# Altium project toilet-sensing-v0.1.PrjPcb
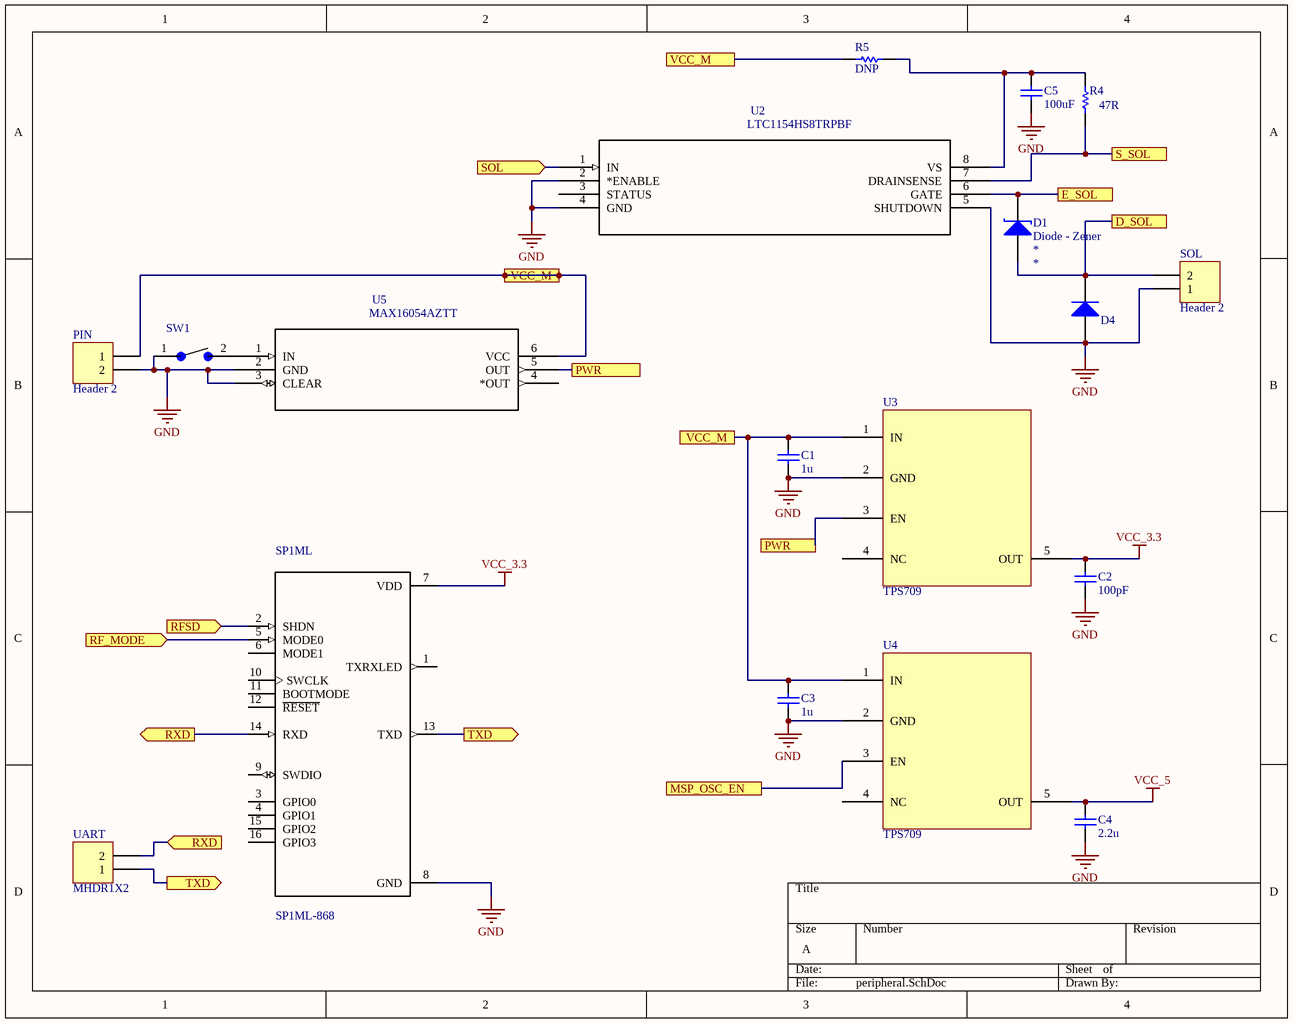
[diagram p0: peripheral.SchDoc]
2 sheets, 31 parts. Net scope: flat (ports and power ports of the same name join across sheets).
Board file: FlowSense-RX.PcbDoc
Sheets:
  peripheral.SchDoc
  MSP430.SchDoc

## Sheet peripheral.SchDoc
size A

### Parts
C1  value 1u  [0402-W]  (hidden comment: Cap)
C2  value 100pF  [0402-W]  (hidden comment: Cap)
C3  value 1u  [0402-W]  (hidden comment: Cap)
C4  value 2.2u  [0402-W]  (hidden comment: Cap)
C5  value 100uF  [0402-W]  (hidden comment: Cap)
D1  Diode - Zener  [SOD-523]
D4  Diode  [DIODE - SOD123]  (value not drawn)
PIN  Header 2  [HDR1X2]
R4  value 47R  [0402]  (hidden comment: R_Pullup_1)
R5  value DNP  [0402]  (hidden comment: R_Pullup_1)
SOL  Header 2  [HDR1X2]
SP1ML  SP1ML-868  [STM_SP1ML-868]
SW1  FSMSM _1437566-3_  [TE_FSMSM]  (value not drawn)
U2  LTC1154HS8TRPBF  [SOIC-8_S]
U3  TPS709  [SOT95P280X145-5N]
U4  TPS709  [SOT95P280X145-5N]
U5  MAX16054AZTT  [21-0114C]
UART  MHDR1X2  [MHDR1X2]

### Ports
D_SOL, E_SOL, MSP_OSC_EN, PWR, RF_MODE (in), RFSD (in), RXD (in), RXD (out), S_SOL, SOL (in), TXD (out), VCC_M

### Nets
GND: C1.1 C2.1 C3.1 C4.1 C5.1 D4.1(A) PIN.2 SOL.1 SP1ML.8(GND) SW1.1 U2.2(*ENABLE) U2.4(GND) U2.5(SHUTDOWN) U3.2(GND) U4.2(GND) U5.2(GND) U5.3(CLEAR)
VCC_3.3: C2.2 SP1ML.7(VDD) U3.5(OUT)
VCC_5: C4.2 U4.5(OUT)
NetC1_2: C1.2 C3.2 PIN.1 R5.2 U3.1(IN) U4.1(IN) U5.6(VCC) ; port VCC_M
NetC5_2: C5.2 R4.2 R5.1 U2.8(VS)
NetD1_1: D1.1(A) D4.2(C) SOL.2 ; port D_SOL
NetD1_2: D1.2(K) U2.6(GATE) ; port E_SOL
NetR4_1: R4.1 U2.7(DRAINSENSE) ; port S_SOL
NetSP1ML_2: SP1ML.2(SHDN) ; port RFSD
NetSP1ML_5: SP1ML.5(MODE0) ; port RF_MODE
NetSP1ML_13: SP1ML.13(TXD) UART.1 ; port TXD
NetSP1ML_14: SP1ML.14(RXD) UART.2 ; port RXD
NetSW1_2: SW1.2 U5.1(IN)
NetU1_3: U2.1(IN) ; port SOL
NetU1_16: U4.3(EN) ; port MSP_OSC_EN
NetU3_3: U3.3(EN) U5.5(OUT) ; port PWR

Not connected (* = marked no-connect by the designer): SP1ML 1(TXRXLED) 3(GPIO0) 4(GPIO1) 6(MODE1) 9(SWDIO) 10(SWCLK) 11(BOOTMODE) 12(~{RESET}) 15(GPIO2) 16(GPIO3); U2 3(STATUS); U3 4(NC); U4 4(NC); U5 4(*OUT)

### Library data of the parts
C1-C5 = Cap: Ceramic Capacitor (Surface Mount); Manufacturer: Generic Ceramic Chip Cap (TBD); Digi-Key Part Number: *; Manufacturer Part Number: *; Note: *; Rating: *
D4 = Diode: General Purpose Diode; Manufacturer: *; Manufacturer Part Number: *; Digi-Key Part Number: *; Value: *; Rating: *; Note: *
PIN SOL = Header 2: Header, 2-Pin; LatestRevisionDate: 17-Jul-2002; LatestRevisionNote: Re-released for DXP Platform.; Publisher: Altium Limited
R4 R5 = Res: Chip Resistor (Surface Mount); Manufacturer: Generic Chip Res (TBD); Manufacturer Part Number: *; Digi-Key Part Number: *; Rating: *; Comment_1: Res
SP1ML = SP1ML-868: RF TXRX MODULE ISM<1GHZ CHIP ANT; MF: STMicroelectronics; Availability: Good; MP: SP1ML-868; Price: 16.88 USD; Package: SMD-16 STMicroelectronics; Value: *
SW1 = FSMSM: FSMSM=3.5X6 SMT TACT; MF: TE Connectivity; Price: None; SnapEDA_Link: https://www.snapeda.com/parts/FSMSM/TE%20Connectivity%20/%20DEUTSCH/view-part/?ref=snap; MP: FSMSM; Availability: Unavailable; Package: None; Value: *
U2 = LTC1154HS8TRPBF: IC MOSFET DRIVER HIGH-SIDE 8SOIC; MF: Linear Technology; MP: LTC1154HS8#TRPBF; Price: 2.92 USD; Package: SOIC-8 Linear Technology; Availability: Unavailable; Value: *
U3 U4 = TPS709: Ultra low power Voltage Regulator
U5 = MAX16054AZTT: On/Off Controller With Debounce And +/-1; MF: Maxim Integrated; MP: MAX16054AZT+; SnapEDA_Link: https://www.snapeda.com/parts/MAX16054AZT%2B/Maxim%20Integrated/view-part/?ref=snap; Package: TSOT-23 Maxim Integrated; Price: 2.94 USD; Availability: Unavailable; Value: *
UART = MHDR1X2: Header, 2-Pin; LatestRevisionDate: 17-Jul-2002; LatestRevisionNote: Re-released for DXP Platform.; Publisher: Altium Limited
D1 = Diode - Zener: Manufacturer Part Number: *; Manufacturer: *; Digi-Key Part Number: *; Note: *; Value: *; Rating: *

## Sheet MSP430.SchDoc
size A
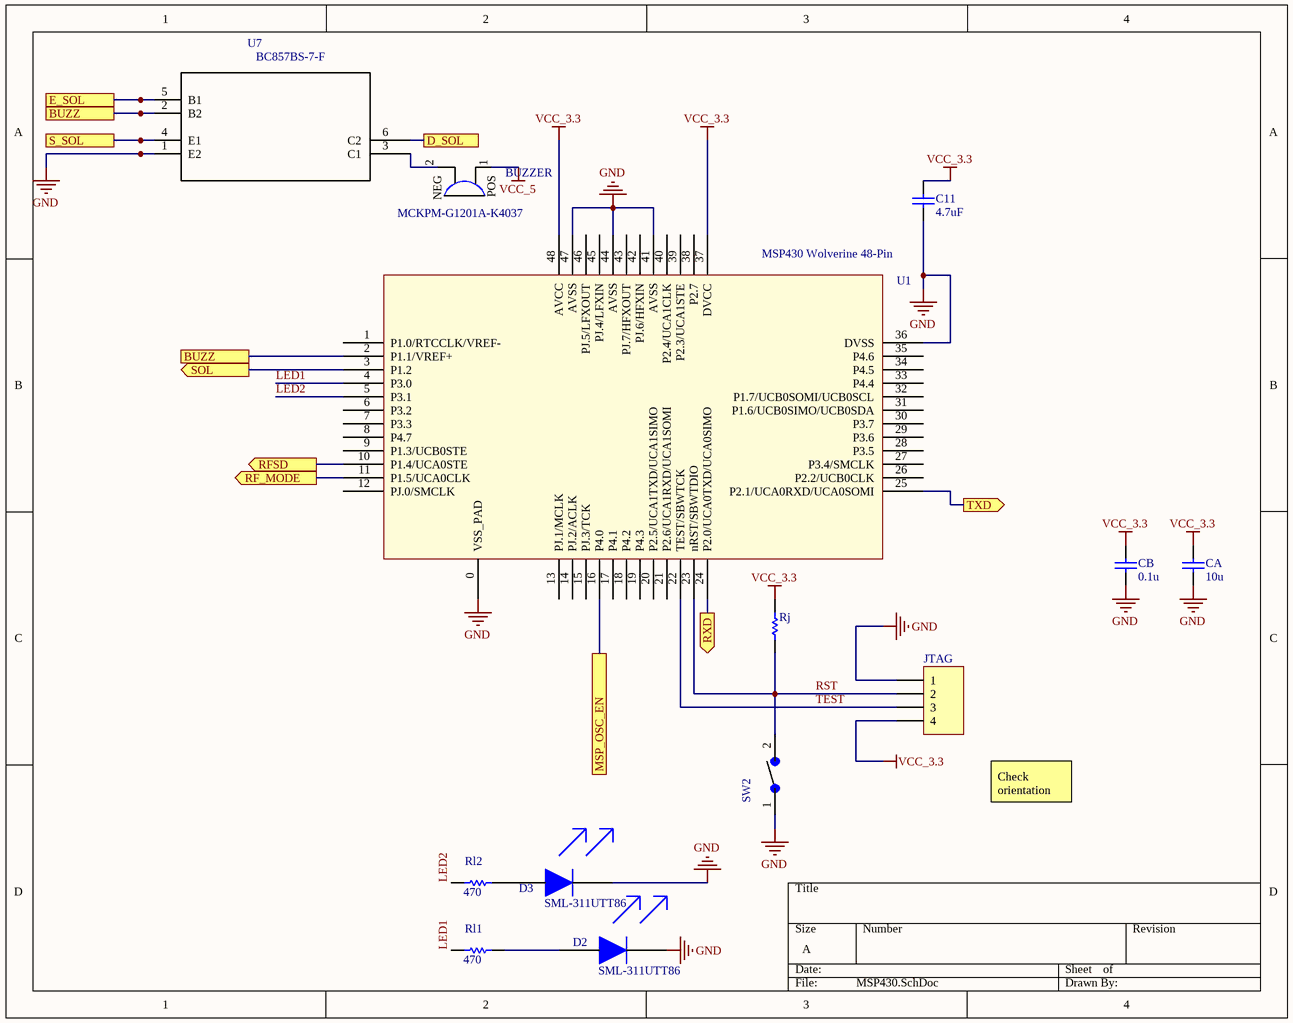
[diagram p1: MSP430.SchDoc]

### Parts
BUZZER  MCKPM-G1201A-K4037  [XDCR_MCKPM-G1201A-K4037]
C11  value 4.7uF  [0402-W]  (hidden comment: Cap)
CA  value 10u  [0402-W]  (hidden comment: Cap)
CB  value 0.1u  [0402-W]  (hidden comment: Cap)
D2  SML-311UTT86  [0603]
D3  SML-311UTT86  [0603]
JTAG  MHDR1X4  [MHDR1X4]  (value not drawn)
Rj  Res  [0402]  (value not drawn)
Rl1  value 470  [0402]  (hidden comment: Res)
Rl2  value 470  [0402]  (hidden comment: Res)
SW2  FSMSM _1437566-3_  [TE_FSMSM]  (value not drawn)
U1  MSP430 Wolverine 48-Pin  [MSP_QFN48_RGZ_PAD0]
U7  BC857BS-7-F  [SOT65P210X100-6N]

### Ports
BUZZ, D_SOL, E_SOL, MSP_OSC_EN, RF_MODE (out), RFSD (out), RXD (out), S_SOL, SOL (out), TXD (out)

### Nets
GND: C11.1 CA.1 CB.1 D2.2 D3.2 JTAG.1 SW2.1 U1.0(VSS_PAD) U1.36(DVSS) U1.41(AVSS) U1.44(AVSS) U1.47(AVSS) U7.1(E2)
VCC_3.3: C11.2 CA.2 CB.2 JTAG.4 Rj.2 U1.37(DVCC) U1.48(AVCC)
VCC_5: BUZZER.1(POS)
LED1: Rl1.2 U1.4(P3.0)
LED2: Rl2.2 U1.5(P3.1)
RST: JTAG.2 Rj.1 SW2.2 U1.23(nRST/SBWTDIO)
TEST: JTAG.3 U1.22(TEST/SBWTCK)
NetBUZZER_2: BUZZER.2(NEG) U7.3(C1)
NetD1_1: U7.6(C2) ; port D_SOL
NetD1_2: U7.5(B1) ; port E_SOL
NetD2_1: D2.1 Rl1.1
NetD3_1: D3.1 Rl2.1
NetR4_1: U7.4(E1) ; port S_SOL
NetSP1ML_2: U1.10(P1.4/UCA0STE) ; port RFSD
NetSP1ML_5: U1.11(P1.5/UCA0CLK) ; port RF_MODE
NetSP1ML_13: U1.25(P2.1/UCA0RXD/UCA0SOMI) ; port TXD
NetSP1ML_14: U1.24(P2.0/UCA0TXD/UCA0SIMO) ; port RXD
NetU1_2: U1.2(P1.1/VREF+) U7.2(B2) ; port BUZZ
NetU1_3: U1.3(P1.2) ; port SOL
NetU1_16: U1.16(P4.0) ; port MSP_OSC_EN

Not connected (* = marked no-connect by the designer): U1 1(P1.0/RTCCLK/VREF-) 6(P3.2) 7(P3.3) 8(P4.7) 9(P1.3/UCB0STE) 12(PJ.0/SMCLK) 13(PJ.1/MCLK) 14(PJ.2/ACLK) 15(PJ.3/TCK) 17(P4.1) 18(P4.2) 19(P4.3) 20(P2.5/UCA1TXD/UCA1SIMO) 21(P2.6/UCA1RXD/UCA1SOMI) 26(P2.2/UCB0CLK) 27(P3.4/SMCLK) 28(P3.5) 29(P3.6) 30(P3.7) 31(P1.6/UCB0SIMO/UCB0SDA) 32(P1.7/UCB0SOMI/UCB0SCL) 33(P4.4) 34(P4.5) 35(P4.6) 38(P2.7) 39(P2.3/UCA1STE) 40(P2.4/UCA1CLK) 42(PJ.6/HFXIN) 43(PJ.7/HFXOUT) 45(PJ.4/LFXIN) 46(PJ.5/LFXOUT)

### Notes on the sheet
- Check orientation

### Library data of the parts
BUZZER = MCKPM-G1201A-K4037: Magnetic Buzzer And Transducer; MF: Multicomp; Availability: Unavailable; Package: None; MP: MCKPM-G1201A-K4037; Price: 0.24 USD; Value: *
C11 CA CB = Cap: as C1 on sheet peripheral; Digi-Key Part Number: *; Manufacturer Part Number: *; Note: *; Rating: *
D2 D3 = SML-311UTT86: LED 630NM RED WTR CLR 0603 SMD
JTAG = MHDR1X4: Header, 4-Pin; LatestRevisionDate: 17-Jul-2002; LatestRevisionNote: Re-released for DXP Platform.; Publisher: Altium Limited
Rj Rl1 Rl2 = Res: as R4 on sheet peripheral; Manufacturer Part Number: *; Digi-Key Part Number: *; Rating: *
  Rj: Note: *
SW2 = FSMSM: as SW1 on sheet peripheral; Price: None; SnapEDA_Link: https://www.snapeda.com/parts/FSMSM/TE%20Connectivity%20/%20DEUTSCH/view-part/?ref=snap; MP: FSMSM; Availability: Unavailable; Package: None; Value: *
U1 = MSP430FR596X_586X_RGZ: 16-bit FRAM MCU
U7 = BC857BS-7-F: BC857BS Series PNP 45 V 200 mW Small Signal Transistor SMT - SOT-363; MF: Diodes Inc.; SnapEDA_Link: https://www.snapeda.com/parts/BC857BS-7-F/Diodes%20Inc./view-part/?ref=snap; MP: BC857BS-7-F; Availability: Good; Price: 0.08 USD; Package: SOT-363 Diodes Inc.; Value: *

## Nets that join several sheets
GND: peripheral (17 pins), MSP430 (13 pins)
VCC_3.3: peripheral (C2.2 SP1ML.7 U3.5), MSP430 (7 pins)
VCC_5: peripheral (C4.2 U4.5), MSP430 (BUZZER.1)
NetD1_1: peripheral (D1.1 D4.2 SOL.2), MSP430 (U7.6)
NetD1_2: peripheral (D1.2 U2.6), MSP430 (U7.5)
NetR4_1: peripheral (R4.1 U2.7), MSP430 (U7.4)
NetSP1ML_2: peripheral (SP1ML.2), MSP430 (U1.10)
NetSP1ML_5: peripheral (SP1ML.5), MSP430 (U1.11)
NetSP1ML_13: peripheral (SP1ML.13 UART.1), MSP430 (U1.25)
NetSP1ML_14: peripheral (SP1ML.14 UART.2), MSP430 (U1.24)
NetU1_3: peripheral (U2.1), MSP430 (U1.3)
NetU1_16: peripheral (U4.3), MSP430 (U1.16)